# EAGLE design MasterOpAmp-design (EAGLE 6.4)

## Sheet 1 of 5
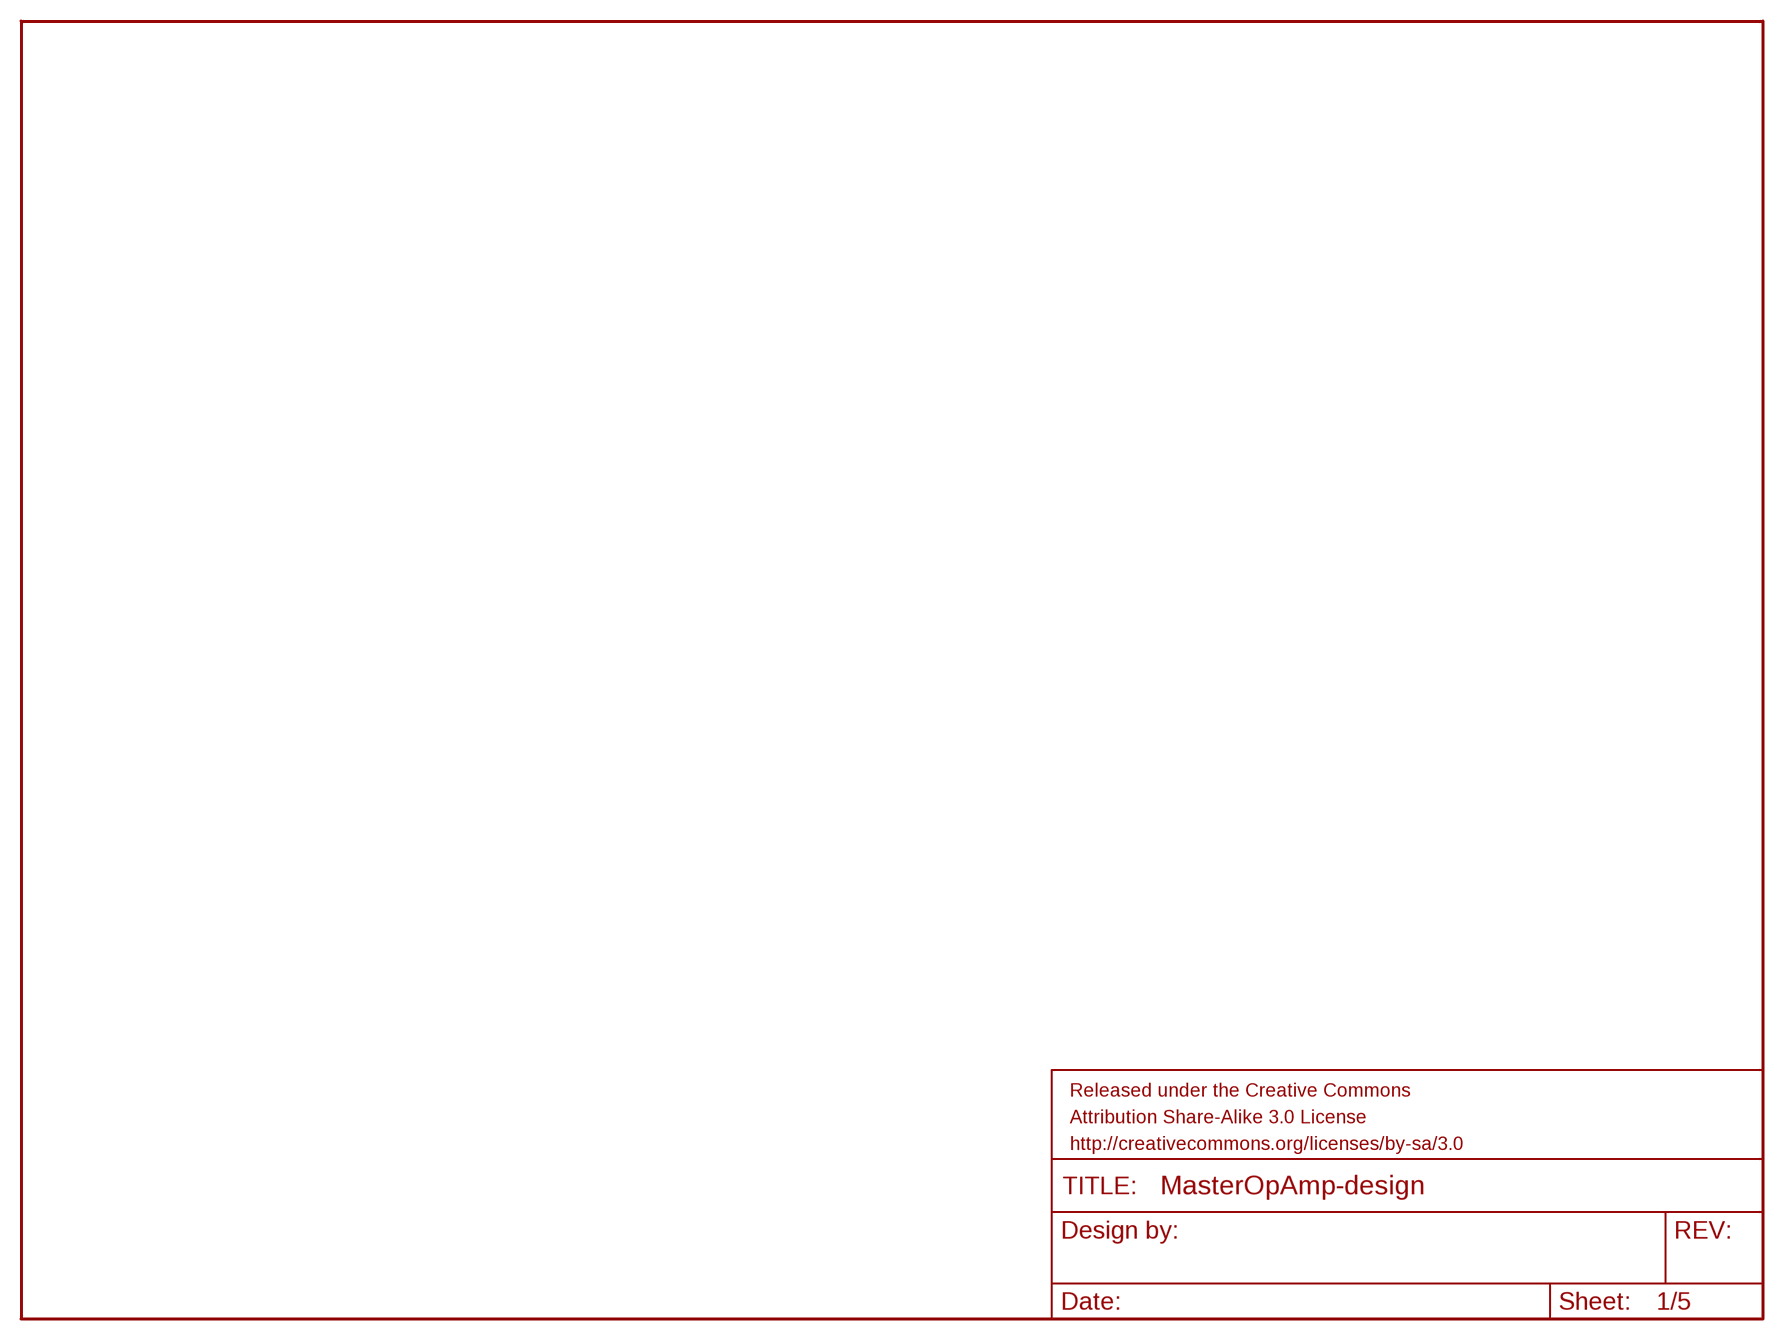
[diagram p0: schematic, sheet 1]

### Parts
FRAME1  FRAME-LETTER  [CREATIVE_COMMONS]

## Sheet 2 of 5
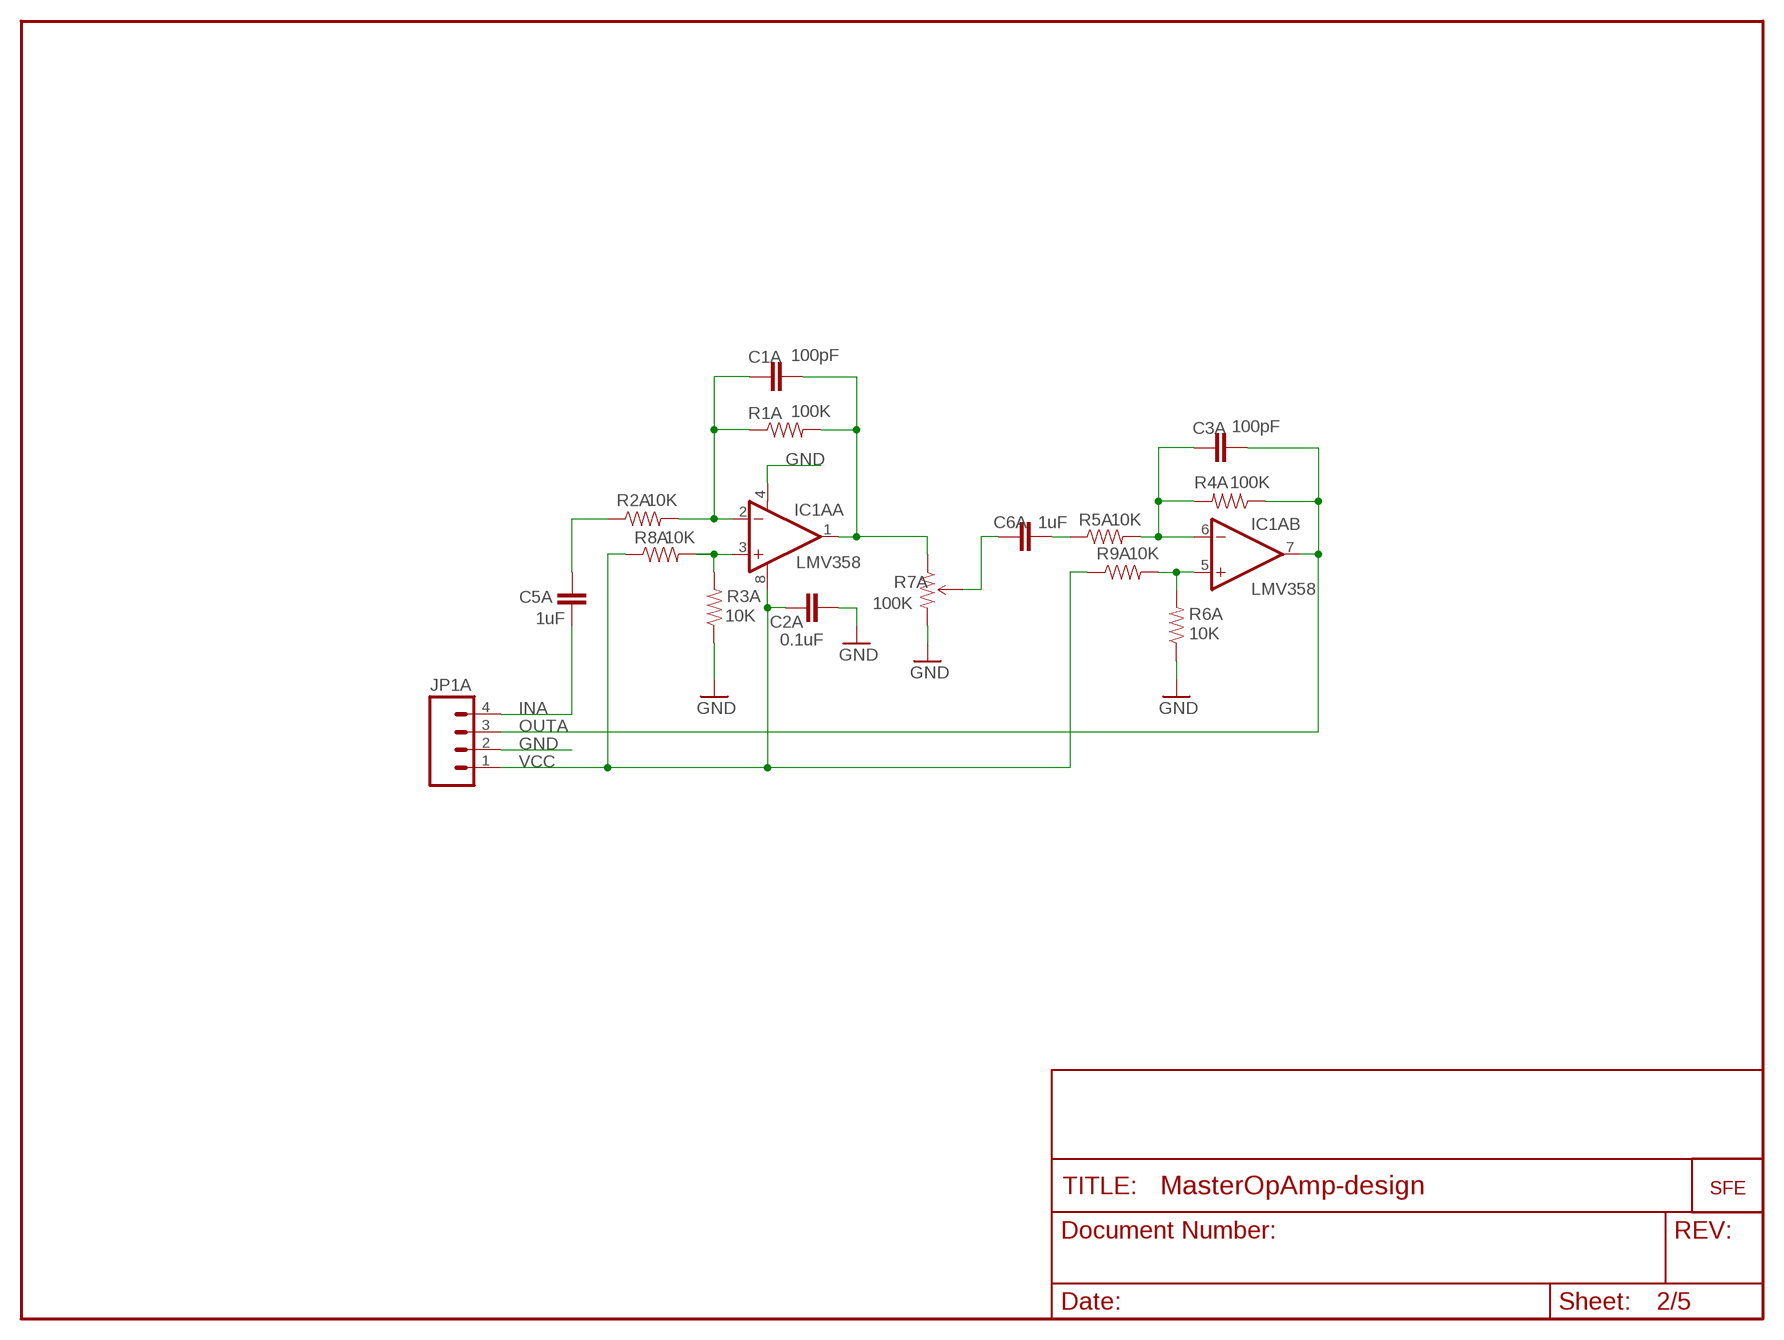
[diagram p1: schematic, sheet 2]

### Parts
C1A  100pF  CAP0402  [C0402]
C2A  0.1uF  CAP0402  [C0402]
C3A  100pF  CAP0402  [C0402]
C5A  1uF  CAP0402  [C0402]
C6A  1uF  CAP0402  [C0402]
IC1A  LMV358  OPAMP-DUALU  [SO08]
JP1A  M04PTH  [1X04]
R1A  100K  RESISTOR0402  [C0402]
R2A  10K  RESISTOR0402  [C0402]
R3A  10K  RESISTOR0402  [C0402]
R4A  100K  RESISTOR0402  [C0402]
R5A  10K  RESISTOR0402  [C0402]
R6A  10K  RESISTOR0402  [C0402]
R7A  100K  TRIMPOTSMD  [TRIMPOT-3MM]
R8A  10K  RESISTOR0402  [C0402]
R9A  10K  RESISTOR0402  [C0402]
U$3A  LOGO-SFENEW  [SFE-NEW-WEBLOGO]

### Nets
GND: C2A.2 IC1A.4(A:V-) JP1A.2 R3A.1 R6A.1 R7A.3(CW) ; also sheet 3,4,5
IN1A: C5A.2 R2A.1
INA: C5A.1 JP1A.4
N$1A: IC1A.5(B:+IN) R6A.2 R9A.2
N$2A: C1A.1 IC1A.2(A:-IN) R1A.1 R2A.2
N$3A: IC1A.3(A:+IN) R3A.2 R8A.2
N$4A: C6A.1 R5A.1
N$5A: C6A.2 R7A.2(WIPER)
N$7A: C3A.1 IC1A.6(B:-IN) R4A.2 R5A.2
OUT1A: C1A.2 IC1A.1(A:OUT) R1A.2 R7A.1(CCW)
OUTA: C3A.2 IC1A.7(B:OUT) JP1A.3 R4A.1
VCC: C2A.1 IC1A.8(A:V+) JP1A.1 R8A.1 R9A.1 ; also sheet 3,4,5

## Sheet 3 of 5
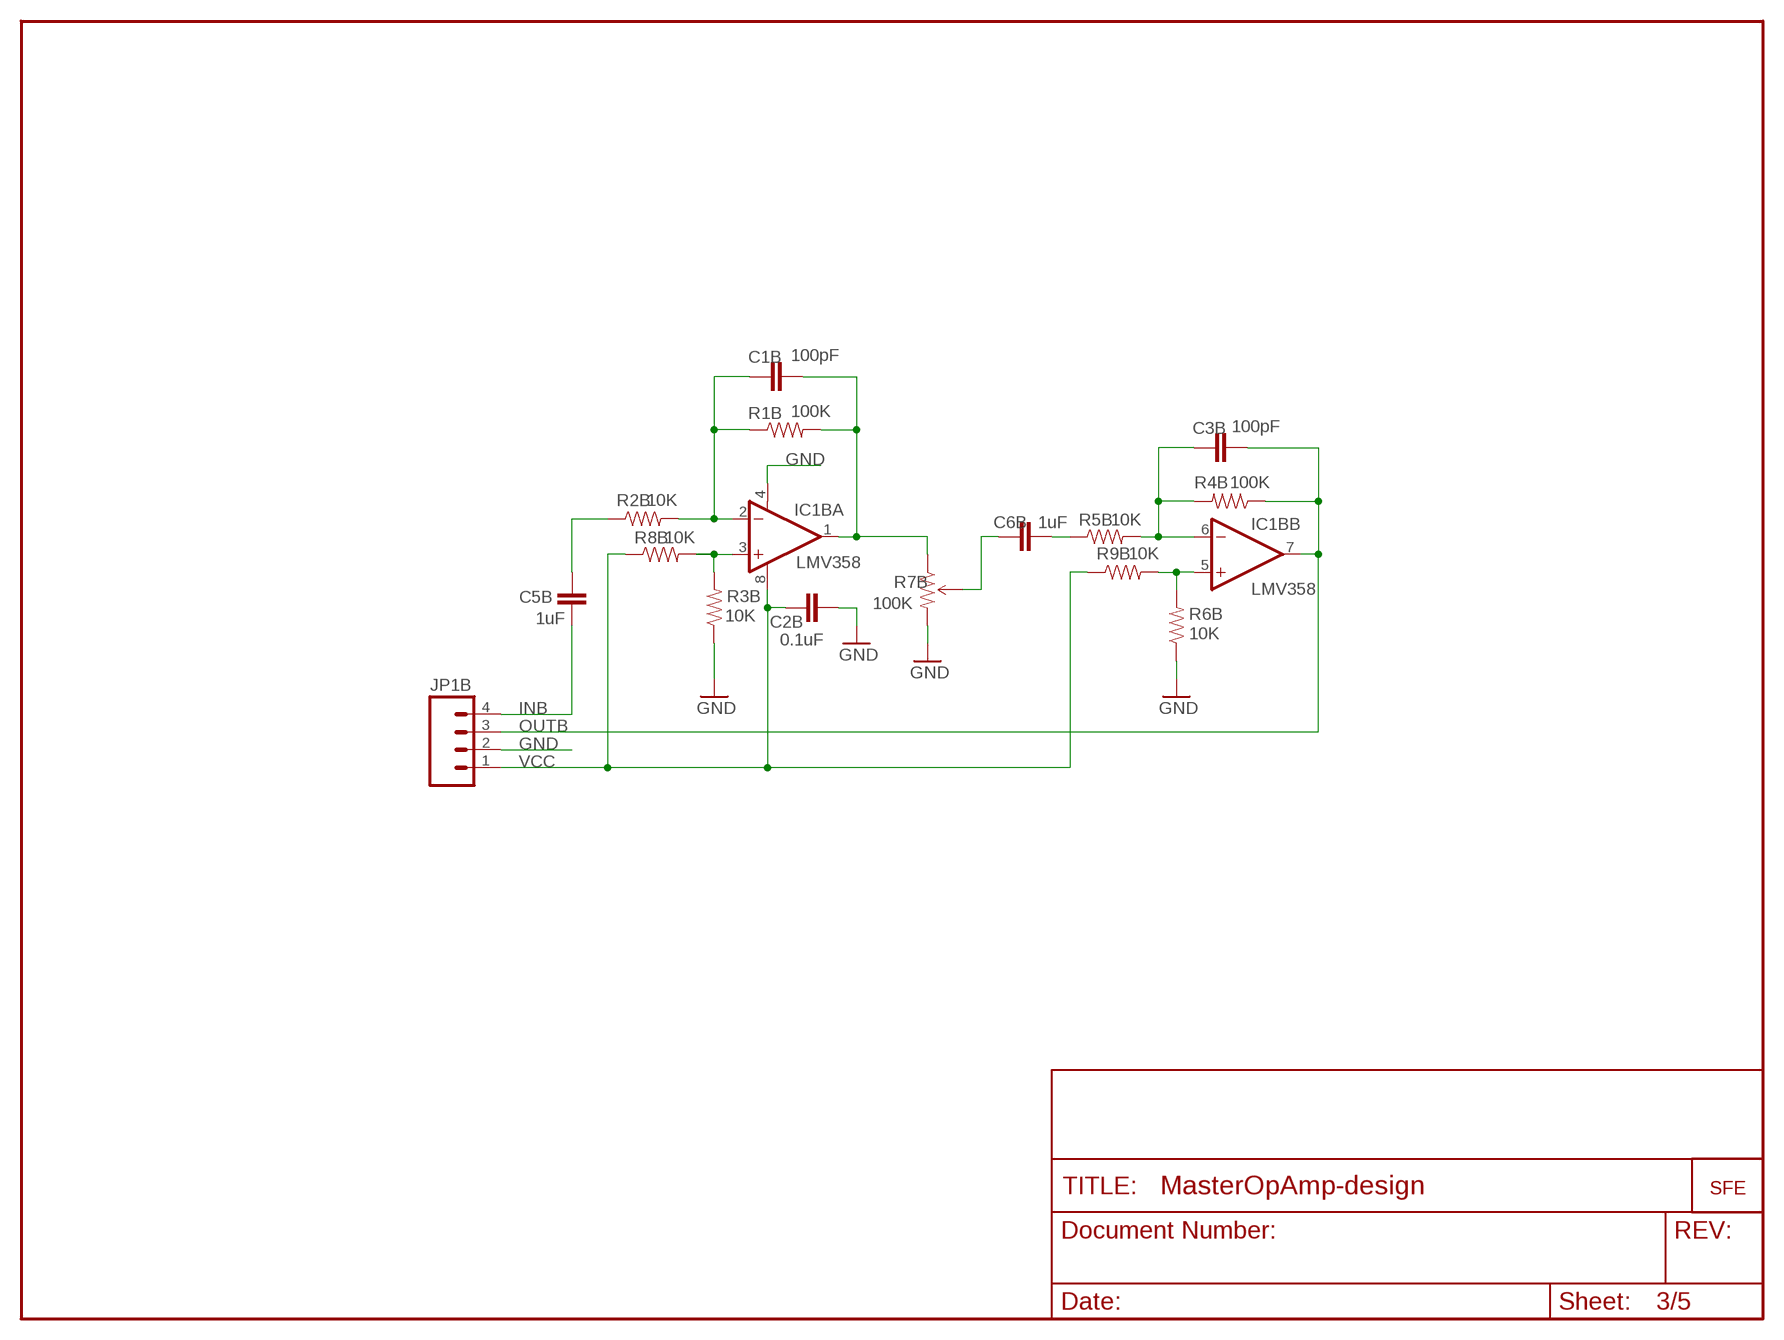
[diagram p2: schematic, sheet 3]

### Parts
C1B  100pF  CAP0402  [C0402]
C2B  0.1uF  CAP0402  [C0402]
C3B  100pF  CAP0402  [C0402]
C5B  1uF  CAP0402  [C0402]
C6B  1uF  CAP0402  [C0402]
IC1B  LMV358  OPAMP-DUALU  [SO08]
JP1B  M04PTH  [1X04]
R1B  100K  RESISTOR0402  [C0402]
R2B  10K  RESISTOR0402  [C0402]
R3B  10K  RESISTOR0402  [C0402]
R4B  100K  RESISTOR0402  [C0402]
R5B  10K  RESISTOR0402  [C0402]
R6B  10K  RESISTOR0402  [C0402]
R7B  100K  TRIMPOTSMD  [TRIMPOT-3MM]
R8B  10K  RESISTOR0402  [C0402]
R9B  10K  RESISTOR0402  [C0402]
U$3B  LOGO-SFENEW  [SFE-NEW-WEBLOGO]

### Nets
GND: C2B.2 IC1B.4(A:V-) JP1B.2 R3B.1 R6B.1 R7B.3(CW) ; also sheet 2,4,5
IN1B: C5B.2 R2B.1
INB: C5B.1 JP1B.4
N$1B: IC1B.5(B:+IN) R6B.2 R9B.2
N$2B: C1B.1 IC1B.2(A:-IN) R1B.1 R2B.2
N$3B: IC1B.3(A:+IN) R3B.2 R8B.2
N$4B: C6B.1 R5B.1
N$5B: C6B.2 R7B.2(WIPER)
N$7B: C3B.1 IC1B.6(B:-IN) R4B.2 R5B.2
OUT1B: C1B.2 IC1B.1(A:OUT) R1B.2 R7B.1(CCW)
OUTB: C3B.2 IC1B.7(B:OUT) JP1B.3 R4B.1
VCC: C2B.1 IC1B.8(A:V+) JP1B.1 R8B.1 R9B.1 ; also sheet 2,4,5

## Sheet 4 of 5
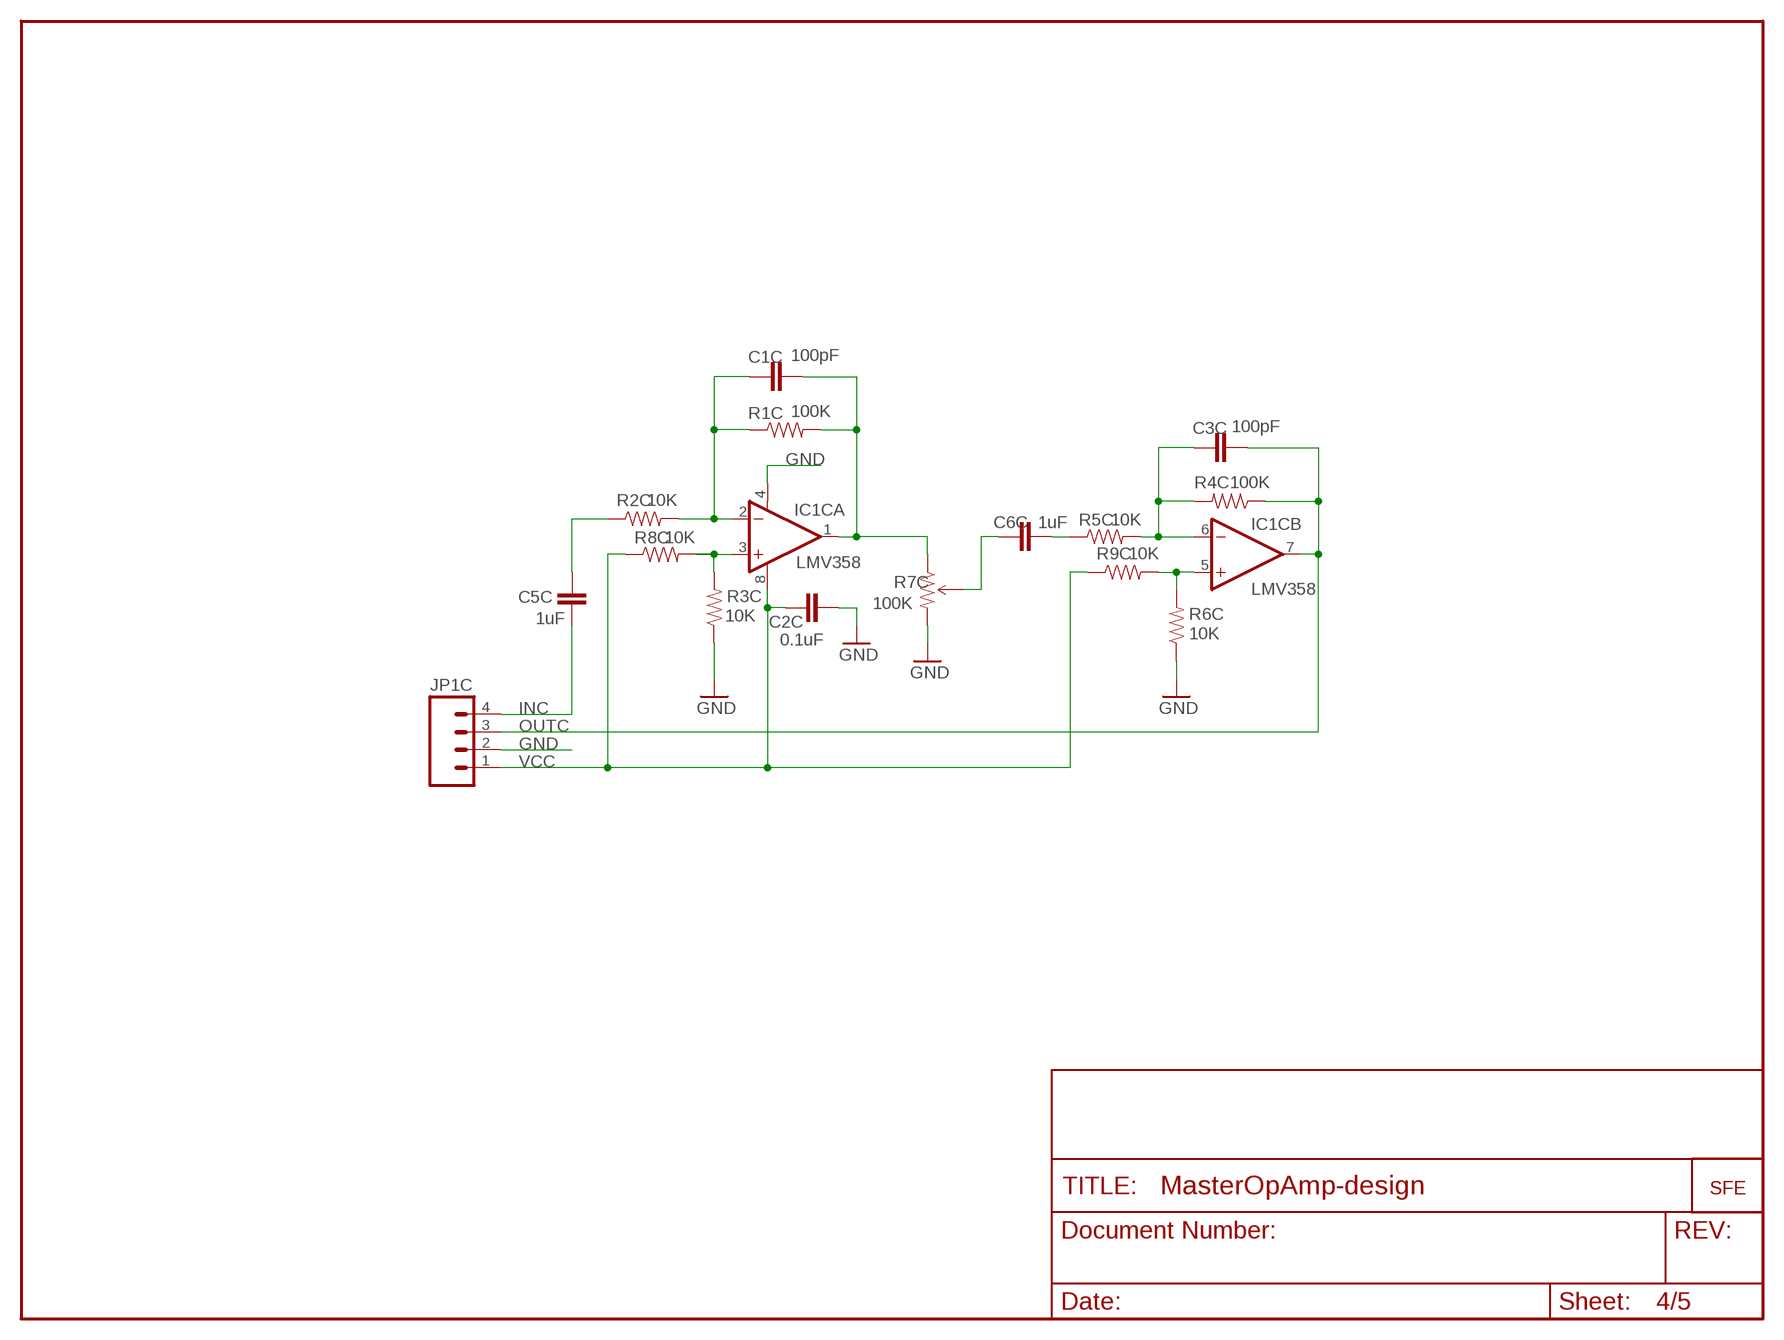
[diagram p3: schematic, sheet 4]

### Parts
C1C  100pF  CAP0402  [C0402]
C2C  0.1uF  CAP0402  [C0402]
C3C  100pF  CAP0402  [C0402]
C5C  1uF  CAP0402  [C0402]
C6C  1uF  CAP0402  [C0402]
IC1C  LMV358  OPAMP-DUALU  [SO08]
JP1C  M04PTH  [1X04]
R1C  100K  RESISTOR0402  [C0402]
R2C  10K  RESISTOR0402  [C0402]
R3C  10K  RESISTOR0402  [C0402]
R4C  100K  RESISTOR0402  [C0402]
R5C  10K  RESISTOR0402  [C0402]
R6C  10K  RESISTOR0402  [C0402]
R7C  100K  TRIMPOTSMD  [TRIMPOT-3MM]
R8C  10K  RESISTOR0402  [C0402]
R9C  10K  RESISTOR0402  [C0402]
U$3C  LOGO-SFENEW  [SFE-NEW-WEBLOGO]

### Nets
GND: C2C.2 IC1C.4(A:V-) JP1C.2 R3C.1 R6C.1 R7C.3(CW) ; also sheet 2,3,5
IN1C: C5C.2 R2C.1
INC: C5C.1 JP1C.4
N$1C: IC1C.5(B:+IN) R6C.2 R9C.2
N$2C: C1C.1 IC1C.2(A:-IN) R1C.1 R2C.2
N$3C: IC1C.3(A:+IN) R3C.2 R8C.2
N$4C: C6C.1 R5C.1
N$5C: C6C.2 R7C.2(WIPER)
N$7C: C3C.1 IC1C.6(B:-IN) R4C.2 R5C.2
OUT1C: C1C.2 IC1C.1(A:OUT) R1C.2 R7C.1(CCW)
OUTC: C3C.2 IC1C.7(B:OUT) JP1C.3 R4C.1
VCC: C2C.1 IC1C.8(A:V+) JP1C.1 R8C.1 R9C.1 ; also sheet 2,3,5

## Sheet 5 of 5
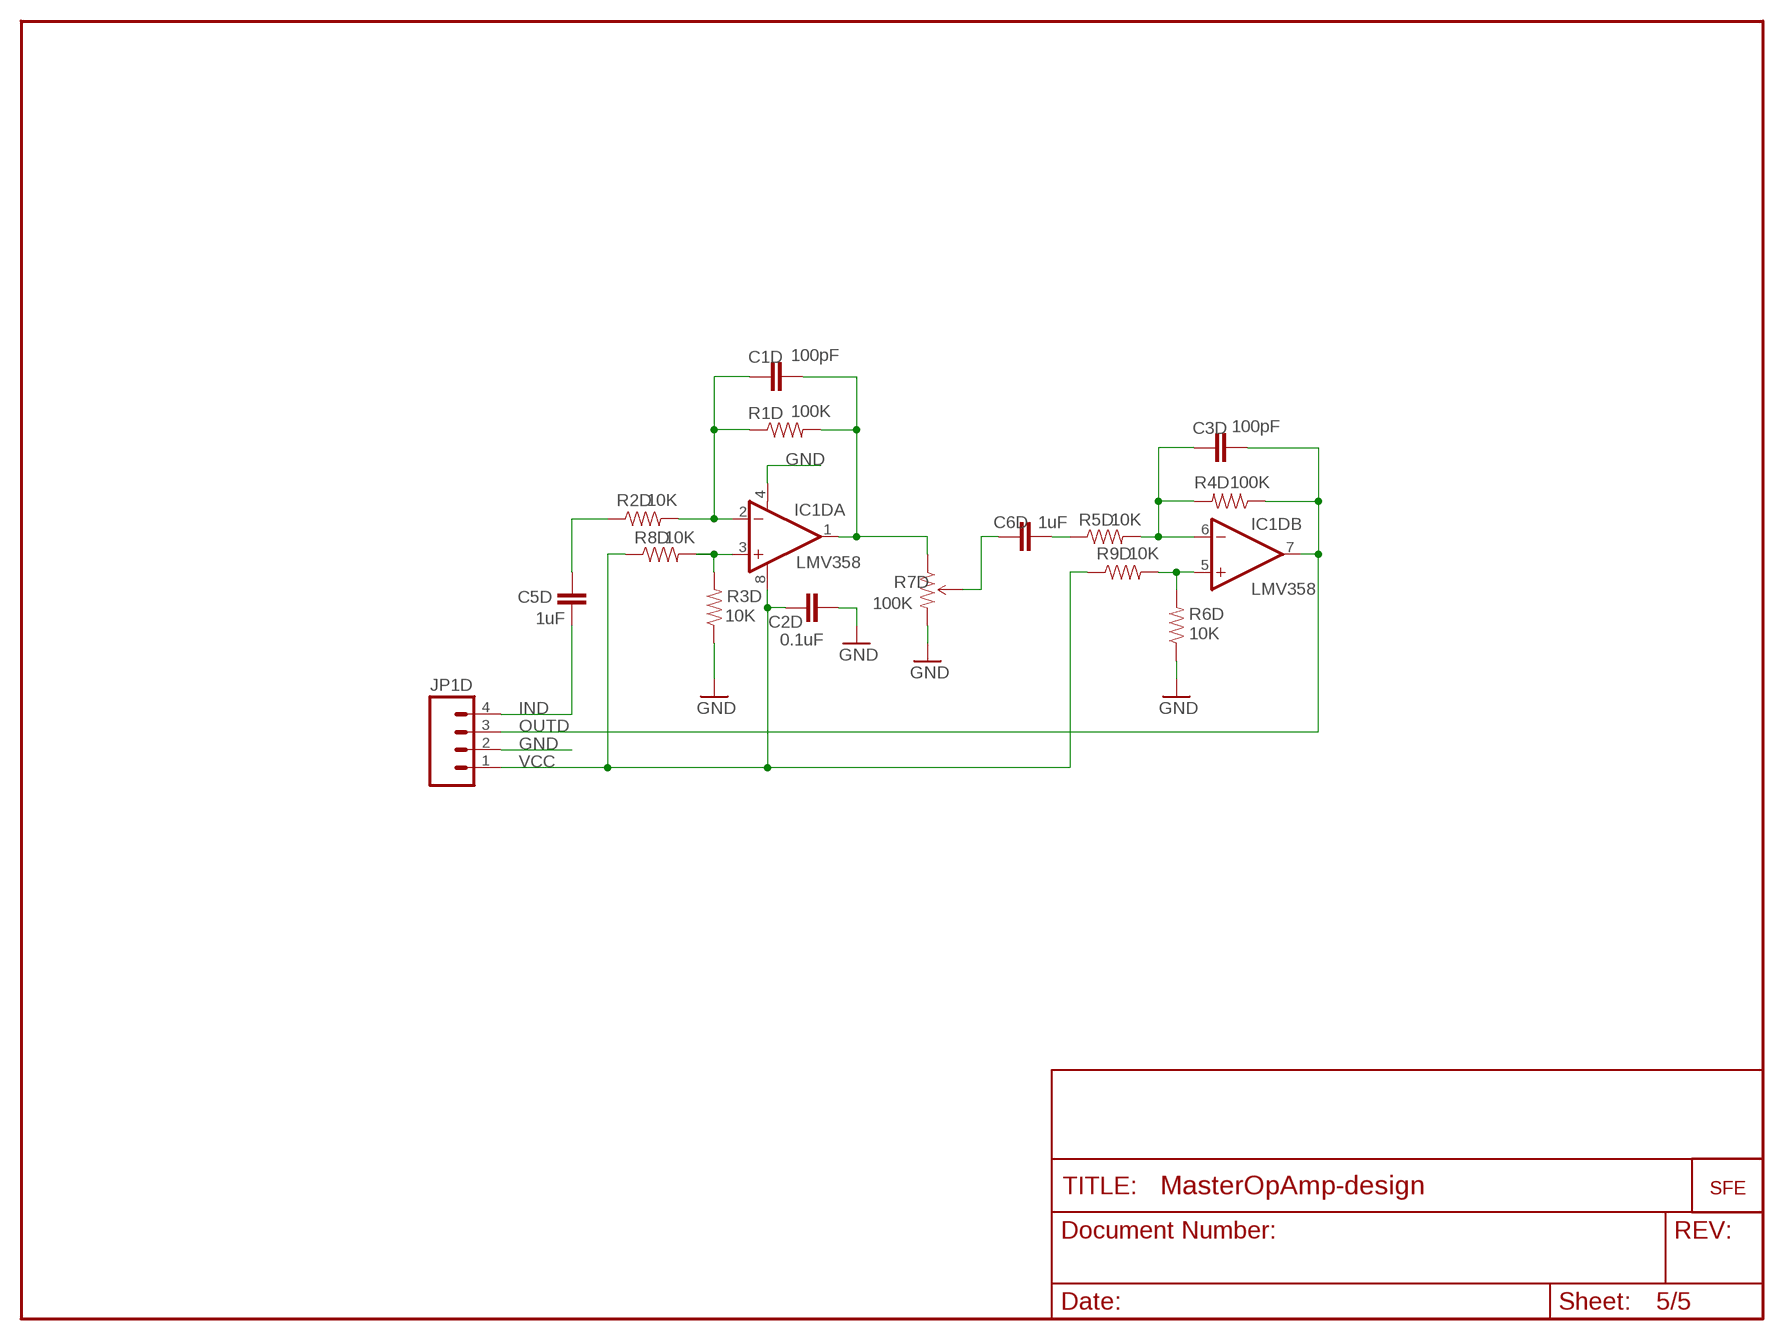
[diagram p4: schematic, sheet 5]

### Parts
C1D  100pF  CAP0402  [C0402]
C2D  0.1uF  CAP0402  [C0402]
C3D  100pF  CAP0402  [C0402]
C5D  1uF  CAP0402  [C0402]
C6D  1uF  CAP0402  [C0402]
IC1D  LMV358  OPAMP-DUALU  [SO08]
JP1D  M04PTH  [1X04]
R1D  100K  RESISTOR0402  [C0402]
R2D  10K  RESISTOR0402  [C0402]
R3D  10K  RESISTOR0402  [C0402]
R4D  100K  RESISTOR0402  [C0402]
R5D  10K  RESISTOR0402  [C0402]
R6D  10K  RESISTOR0402  [C0402]
R7D  100K  TRIMPOTSMD  [TRIMPOT-3MM]
R8D  10K  RESISTOR0402  [C0402]
R9D  10K  RESISTOR0402  [C0402]
U$3D  LOGO-SFENEW  [SFE-NEW-WEBLOGO]

### Nets
GND: C2D.2 IC1D.4(A:V-) JP1D.2 R3D.1 R6D.1 R7D.3(CW) ; also sheet 2,3,4
IN1D: C5D.2 R2D.1
IND: C5D.1 JP1D.4
N$1D: IC1D.5(B:+IN) R6D.2 R9D.2
N$2D: C1D.1 IC1D.2(A:-IN) R1D.1 R2D.2
N$3D: IC1D.3(A:+IN) R3D.2 R8D.2
N$4D: C6D.1 R5D.1
N$5D: C6D.2 R7D.2(WIPER)
N$7D: C3D.1 IC1D.6(B:-IN) R4D.2 R5D.2
OUT1D: C1D.2 IC1D.1(A:OUT) R1D.2 R7D.1(CCW)
OUTD: C3D.2 IC1D.7(B:OUT) JP1D.3 R4D.1
VCC: C2D.1 IC1D.8(A:V+) JP1D.1 R8D.1 R9D.1 ; also sheet 2,3,4

## Library data of the parts
C1A C1B C1C C1D C2A C2B C2C C2D C3A C3B C3C C3D C5A C5B C5C C5D C6A C6B C6C C6D = SparkFun:CAP: Capacitor Standard 0603 ceramic capacitor, and 0.1" leaded capacitor.
FRAME1 = SparkFun-Aesthetics:FRAME-LETTER: Schematic Frame Standard 8.5x11 US Letter frame
IC1A IC1B IC1C IC1D = SparkFun:OPAMP-DUAL: Operational Amplifier
JP1A JP1B JP1C JP1D = SparkFun:M04: Header 4 Standard 4-pin 0.1" header. Use with straight break away headers (SKU : PRT-00116), right angle break away headers (PRT-00553), swiss pins (PRT-00743), machine pins (PRT-00117), and female headers (PRT-00115). Molex polarized connector foot print use with SKU : PRT-08231 with associated crimp pins and housings.
R1A R1B R1C R1D R2A R2B R2C R2D R3A R3B R3C R3D R4A R4B R4C R4D R5A R5B R5C R5D R6A R6B R6C R6D = SparkFun:RESISTOR: Resistor Basic schematic elements and footprints for 0603, 1206, and PTH 1/10th watt (small) resistors.
R7A R7B R7C R7D = SparkFun:TRIMPOT
R8A R8B R8C R8D R9A R9B R9C R9D = SparkFun-DC:RESISTOR: Resistor Basic schematic elements and footprints for 0603, 1206, and PTH 1/10th watt (small) resistors.
U$3A U$3B U$3C U$3D = SparkFun:LOGO-SFE: Spark Fun Electronics PCB Logo This is the standard Spark Fun Electronics PCB logo.

## Board
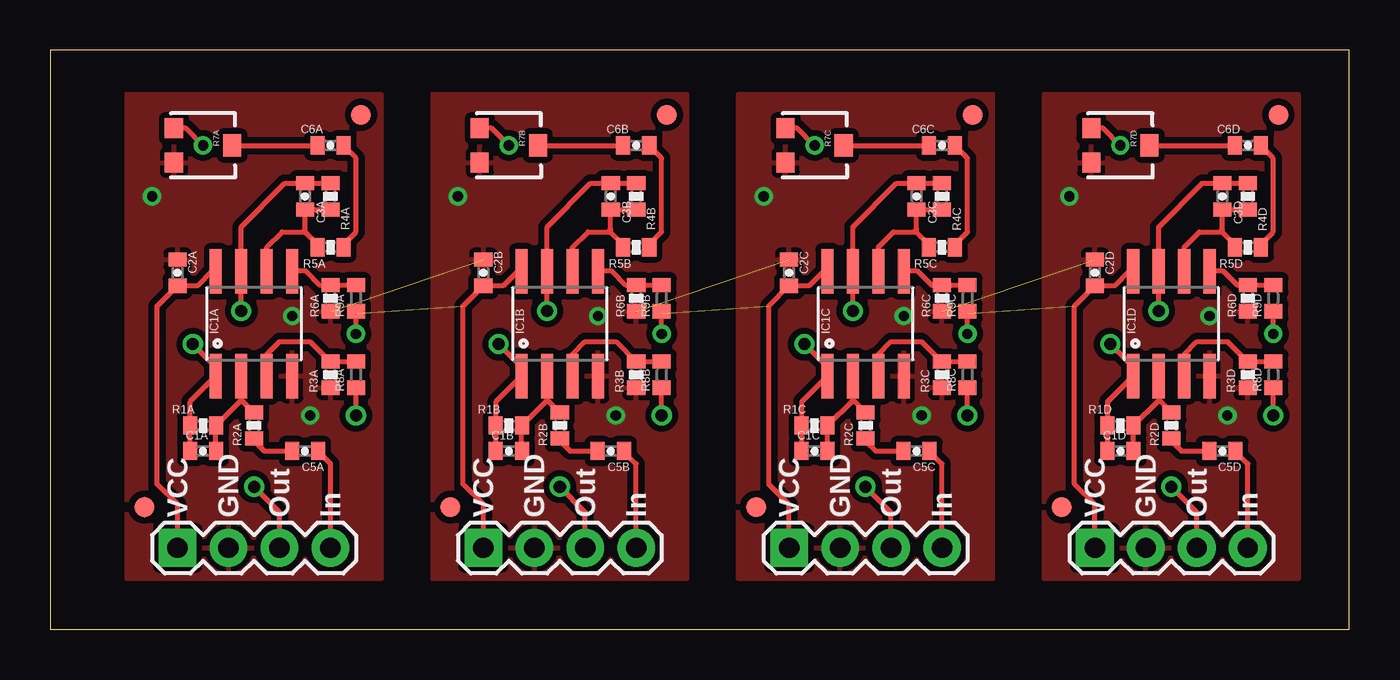
[diagram p5: board, top side]
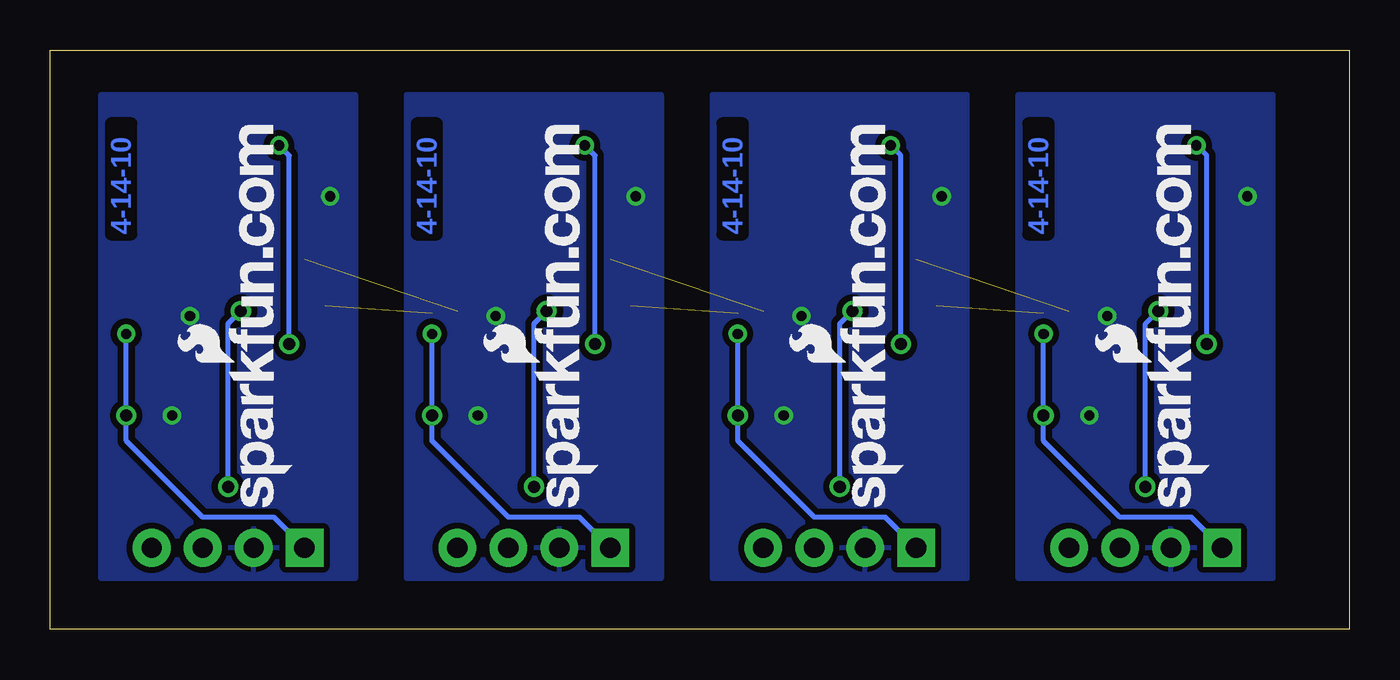
[diagram p6: board, bottom side, seen from below]

Size 64.75 x 28.88 mm. Coordinates in mm from the lower left corner, seen from the top.
Outline: 0,0 64.75,0 64.75,28.88 0,28.88 0,0
Copper layers (1*16): Top 0.035mm / dielectric 1.5mm / Bottom 0.035mm
Design rules "default": minimum track width 10mil, minimum drill 24mil, track to track 8mil, track to pad 8mil, pad to pad 8mil, via to via 8mil, smd to smd 8mil, copper to edge 40mil, drill to drill 8mil, minimum pad ring 10mil, minimum via ring 8mil, stop-mask expansion 4mil, vias tented up to drill 0mil, thermal gap 10mil

### Footprints (pad centres in the part's own frame; a part is rotated, then mirrored left to right if it is on the bottom)
0402-CAP = smd 0.7 x 0.9: 1 -0.65,0; 2 0.65,0
FIDUCIAL-1X2 = smd 1 x 1: 1 0,0
SO08@1 = smd 0.61 x 2.21: 1 -1.905,-2.616; 2 -0.635,-2.616; 3 0.635,-2.616; 4 1.905,-2.616; 5 1.905,2.616; 6 0.635,2.616; 7 -0.635,2.616; 8 -1.905,2.616
SO08@2 = smd 0.61 x 2.21: 1 -1.905,-2.616; 2 -0.635,-2.616; 3 0.635,-2.616; 4 1.905,-2.616; 5 1.905,2.616; 6 0.635,2.616; 7 -0.635,2.616; 8 -1.905,2.616
SO08@3 = smd 0.61 x 2.21: 1 -1.905,-2.616; 2 -0.635,-2.616; 3 0.635,-2.616; 4 1.905,-2.616; 5 1.905,2.616; 6 0.635,2.616; 7 -0.635,2.616; 8 -1.905,2.616
SO08 = smd 0.61 x 2.21: 1 -1.905,-2.616; 2 -0.635,-2.616; 3 0.635,-2.616; 4 1.905,-2.616; 5 1.905,2.616; 6 0.635,2.616; 7 -0.635,2.616; 8 -1.905,2.616
1X04@1 = drill 1.016 pad 1.88 square: 1 0,0 | drill 1.016 pad 1.88: 2 2.54,0; 3 5.08,0; 4 7.62,0
1X04@2 = drill 1.016 pad 1.88 square: 1 0,0 | drill 1.016 pad 1.88: 2 2.54,0; 3 5.08,0; 4 7.62,0
1X04@3 = drill 1.016 pad 1.88 square: 1 0,0 | drill 1.016 pad 1.88: 2 2.54,0; 3 5.08,0; 4 7.62,0
1X04 = drill 1.016 pad 1.88 square: 1 0,0 | drill 1.016 pad 1.88: 2 2.54,0; 3 5.08,0; 4 7.62,0
0402-RES = smd 0.7 x 0.9: 1 -0.65,0; 2 0.65,0
TRIMPOT-3MM = smd 1 x 0.9: 1 -0.85,-1.45; 3 0.85,-1.45 | smd 1.1 x 0.9: 2 0,1.45
C0402 = smd 0.7 x 0.9: 1 -0.65,0; 2 0.65,0

### Placement (x,y rotation side)
C1A  100pF  [0402-CAP]  7.62,8.89 180 top
C1B  100pF  [0402-CAP]  22.86,8.89 180 top
C1C  100pF  [0402-CAP]  38.1,8.89 180 top
C1D  100pF  [0402-CAP]  53.34,8.89 180 top
C2A  0.1uF  [0402-CAP]  6.35,17.78 90 top
C2B  0.1uF  [0402-CAP]  21.59,17.78 90 top
C2C  0.1uF  [0402-CAP]  36.83,17.78 90 top
C2D  0.1uF  [0402-CAP]  52.07,17.78 90 top
C3A  100pF  [0402-CAP]  12.7,21.59 90 top
C3B  100pF  [0402-CAP]  27.94,21.59 90 top
C3C  100pF  [0402-CAP]  43.18,21.59 90 top
C3D  100pF  [0402-CAP]  58.42,21.59 90 top
C5A  1uF  [0402-CAP]  12.7,8.89 180 top
C5B  1uF  [0402-CAP]  27.94,8.89 180 top
C5C  1uF  [0402-CAP]  43.18,8.89 180 top
C5D  1uF  [0402-CAP]  58.42,8.89 180 top
C6A  1uF  [0402-CAP]  13.97,24.13 180 top
C6B  1uF  [0402-CAP]  29.21,24.13 180 top
C6C  1uF  [0402-CAP]  44.45,24.13 180 top
C6D  1uF  [0402-CAP]  59.69,24.13 180 top
E$1A  [FIDUCIAL-1X2]  15.49,25.65 0 top
E$1B  [FIDUCIAL-1X2]  30.73,25.65 0 top
E$1C  [FIDUCIAL-1X2]  45.97,25.65 0 top
E$1D  [FIDUCIAL-1X2]  61.21,25.65 0 top
E$2A  [FIDUCIAL-1X2]  4.7,6.1 0 top
E$2B  [FIDUCIAL-1X2]  19.94,6.1 0 top
E$2C  [FIDUCIAL-1X2]  35.18,6.1 0 top
E$2D  [FIDUCIAL-1X2]  50.42,6.1 0 top
FRAME1  21.59,-7.62 0 top  (outside the outline)
IC1A  LMV358  [SO08@1]  10.16,15.24 0 top
IC1B  LMV358  [SO08@2]  25.4,15.24 0 top
IC1C  LMV358  [SO08@3]  40.64,15.24 0 top
IC1D  55.88,15.24 0 top
JP1A  [1X04@1]  6.35,4.06 0 top
JP1B  [1X04@2]  21.59,4.06 0 top
JP1C  [1X04@3]  36.83,4.06 0 top
JP1D  52.07,4.06 0 top
R1A  100K  [0402-RES]  7.62,10.16 180 top
R1B  100K  [0402-RES]  22.86,10.16 180 top
R1C  100K  [0402-RES]  38.1,10.16 180 top
R1D  100K  [0402-RES]  53.34,10.16 180 top
R2A  10K  [0402-RES]  10.16,10.16 90 top
R2B  10K  [0402-RES]  25.4,10.16 90 top
R2C  10K  [0402-RES]  40.64,10.16 90 top
R2D  10K  [0402-RES]  55.88,10.16 90 top
R3A  10K  [0402-RES]  13.97,12.7 90 top
R3B  10K  [0402-RES]  29.21,12.7 90 top
R3C  10K  [0402-RES]  44.45,12.7 90 top
R3D  10K  [0402-RES]  59.69,12.7 90 top
R4A  100K  [0402-RES]  13.97,21.59 270 top
R4B  100K  [0402-RES]  29.21,21.59 270 top
R4C  100K  [0402-RES]  44.45,21.59 270 top
R4D  100K  [0402-RES]  59.69,21.59 270 top
R5A  10K  [0402-RES]  13.97,19.05 180 top
R5B  10K  [0402-RES]  29.21,19.05 180 top
R5C  10K  [0402-RES]  44.45,19.05 180 top
R5D  10K  [0402-RES]  59.69,19.05 180 top
R6A  10K  [0402-RES]  13.97,16.51 90 top
R6B  10K  [0402-RES]  29.21,16.51 90 top
R6C  10K  [0402-RES]  44.45,16.51 90 top
R6D  10K  [0402-RES]  59.69,16.51 90 top
R7A  7.62,24.13 270 top
R7B  22.86,24.13 270 top
R7C  38.1,24.13 270 top
R7D  53.34,24.13 270 top
R8A  15.24,12.7 90 top
R8B  30.48,12.7 90 top
R8C  45.72,12.7 90 top
R8D  60.96,12.7 90 top
R9A  15.24,16.51 90 top
R9B  30.48,16.51 90 top
R9C  45.72,16.51 90 top
R9D  60.96,16.51 90 top
U$3A  6.98,6.11 90 bottom
U$3B  22.22,6.11 90 bottom
U$3C  37.46,6.11 90 bottom
U$3D  52.7,6.11 90 bottom

### Tracks (layer width: path | path; a pad name or v marks a point on that pad's centre or on a via)
GND  (via drill 0.51)  (3 unrouted)
  other vias: 5.08,21.59 12.06,15.62 12.95,10.67 20.32,21.59 27.3,15.62 28.19,10.67 35.56,21.59 42.55,15.62 43.43,10.67 50.8,21.59 57.78,15.62 58.67,10.67
  pour Top (isolate 0.305): 3.81,2.54 16.51,2.54 16.51,26.67 3.81,26.67
  pour Bottom (isolate 0.305): 3.81,2.54 16.51,2.54 16.51,26.67 3.81,26.67
  pour Bottom (isolate 0.305): 3.81,2.54 3.81,26.67 16.51,26.67 16.51,2.54
  pour Top (isolate 0.305): 19.05,2.54 31.75,2.54 31.75,26.67 19.05,26.67
  pour Bottom (isolate 0.305): 19.05,2.54 31.75,2.54 31.75,26.67 19.05,26.67
  pour Bottom (isolate 0.305): 19.05,2.54 19.05,26.67 31.75,26.67 31.75,2.54
  pour Top (isolate 0.305): 34.29,2.54 46.99,2.54 46.99,26.67 34.29,26.67
  pour Bottom (isolate 0.305): 34.29,2.54 46.99,2.54 46.99,26.67 34.29,26.67
  pour Bottom (isolate 0.305): 34.29,2.54 34.29,26.67 46.99,26.67 46.99,2.54
  pour Top (isolate 0.305): 49.53,2.54 62.23,2.54 62.23,26.67 49.53,26.67
  pour Bottom (isolate 0.305): 49.53,2.54 62.23,2.54 62.23,26.67 49.53,26.67
  pour Bottom (isolate 0.305): 49.53,2.54 49.53,26.67 62.23,26.67 62.23,2.54
IN1A
  Top 0.254: R2A.1 10.16,9.4 10.67,8.89 C5A.2
IN1B
  Top 0.254: R2B.1 25.4,9.4 25.91,8.89 C5B.2
IN1C
  Top 0.254: R2C.1 40.64,9.4 41.15,8.89 C5C.2
IN1D
  Top 0.254: R2D.1 55.88,9.4 56.39,8.89 C5D.2
INA
  Top 0.254: C5A.1 13.34,8.89 13.97,8.26 JP1A.4
INB
  Top 0.254: C5B.1 28.57,8.89 29.21,8.26 JP1B.4
INC
  Top 0.254: C5C.1 43.81,8.89 44.45,8.26 JP1C.4
IND
  Top 0.254: C5D.1 59.05,8.89 59.69,8.26 JP1D.4
N$1A
  Top 0.254: R6A.2 13.86,17.16 13.84,17.14 | R6A.2 R9A.2 | IC1A.5 12.75,17.86 13.46,17.14 13.72,17.14 13.84,17.27 13.96,17.16 R6A.2
N$1B
  Top 0.254: R6B.2 29.1,17.16 29.08,17.14 | R6B.2 R9B.2 | IC1B.5 27.99,17.86 28.7,17.14 28.96,17.14 29.08,17.27 29.2,17.16 R6B.2
N$1C
  Top 0.254: R6C.2 44.34,17.16 44.32,17.14 | R6C.2 R9C.2 | IC1C.5 43.23,17.86 43.94,17.14 44.2,17.14 44.32,17.27 44.44,17.16 R6C.2
N$1D
  Top 0.254: R6D.2 59.58,17.16 59.56,17.14 | R6D.2 R9D.2 | IC1D.5 58.47,17.86 59.18,17.14 59.44,17.14 59.56,17.27 59.67,17.16 R6D.2
N$2A
  Top 0.254: 9.87,10.71 R2A.2 10.16,10.79 9.53,11.43 | 9.53,11.43 IC1A.2 | 9.53,11.43 9.53,11.41 R1A.1 8.26,10.16 8.26,8.9 C1A.1
N$2B
  Top 0.254: 25.11,10.71 R2B.2 25.4,10.79 24.77,11.43 | 24.77,11.43 IC1B.2 | 24.77,11.43 24.77,11.41 R1B.1 23.5,10.16 23.5,8.9 C1B.1
N$2C
  Top 0.254: 40.35,10.71 R2C.2 40.64,10.79 40.01,11.43 | 40.01,11.43 IC1C.2 | 40.01,11.43 40.01,11.41 R1C.1 38.73,10.16 38.73,8.9 C1C.1
N$2D
  Top 0.254: 55.59,10.71 R2D.2 55.88,10.79 55.24,11.43 | 55.24,11.43 IC1D.2 | 55.24,11.43 55.24,11.41 R1D.1 53.98,10.16 53.98,8.9 C1D.1
N$3A
  Top 0.254: R3A.2 13.86,13.35 13.84,13.34 | R3A.2 R8A.2 | IC1A.3 10.79,13.72 11.43,14.35 12.95,14.35 13.97,13.34 R3A.2
N$3B
  Top 0.254: R3B.2 29.1,13.35 29.08,13.34 | R3B.2 R8B.2 | IC1B.3 26.04,13.72 26.67,14.35 28.19,14.35 29.21,13.34 R3B.2
N$3C
  Top 0.254: R3C.2 44.34,13.35 44.32,13.34 | R3C.2 R8C.2 | IC1C.3 41.27,13.72 41.91,14.35 43.43,14.35 44.45,13.34 R3C.2
N$3D
  Top 0.254: R3D.2 59.58,13.35 59.56,13.34 | R3D.2 R8D.2 | IC1D.3 56.52,13.72 57.15,14.35 58.67,14.35 59.69,13.34 R3D.2
N$4A
  Top 0.254: R5A.1 14.62,19.19 15.24,19.81 15.24,23.5 14.61,24.13 C6A.1
N$4B
  Top 0.254: R5B.1 29.86,19.19 30.48,19.81 30.48,23.5 29.84,24.13 C6B.1
N$4C
  Top 0.254: R5C.1 45.1,19.19 45.72,19.81 45.72,23.5 45.09,24.13 C6C.1
N$4D
  Top 0.254: R5D.1 60.34,19.19 60.96,19.81 60.96,23.5 60.33,24.13 C6D.1
N$5A
  Top 0.254: R7A.2 C6A.2
N$5B
  Top 0.254: R7B.2 C6B.2
N$5C
  Top 0.254: R7C.2 C6C.2
N$5D
  Top 0.254: R7D.2 C6D.2
N$7A
  Top 0.254: IC1A.6 10.79,19.05 11.56,19.81 12.57,19.81 | R5A.2 13.32,19.16 13.34,19.18 12.7,19.81 12.57,19.81 | 12.57,19.81 12.7,19.94 C3A.1 13.96,20.94 13.97,20.95 R4A.2
N$7B
  Top 0.254: IC1B.6 26.04,19.05 26.8,19.81 27.81,19.81 | R5B.2 28.56,19.16 28.57,19.18 27.94,19.81 27.81,19.81 | 27.81,19.81 27.94,19.94 C3B.1 29.2,20.94 29.21,20.95 R4B.2
N$7C
  Top 0.254: IC1C.6 41.27,19.05 42.04,19.81 43.05,19.81 | R5C.2 43.8,19.16 43.81,19.18 43.18,19.81 43.05,19.81 | 43.05,19.81 43.18,19.94 C3C.1 44.44,20.94 44.45,20.95 R4C.2
N$7D
  Top 0.254: IC1D.6 56.52,19.05 57.28,19.81 58.29,19.81 | R5D.2 59.04,19.16 59.05,19.18 58.42,19.81 58.29,19.81 | 58.29,19.81 58.42,19.94 C3D.1 59.67,20.94 59.69,20.95 R4D.2
OUT1A  (via drill 0.51, 0.6)
  Top 0.254: C1A.2 6.99,8.89 6.99,10.14 R1A.2 6.99,10.16 6.99,11.35 IC1A.1 8.26,13.08 v7.11,14.22 | v7.62,24.13 6.77,24.98 R7A.1
  Bottom 0.254: v7.11,14.22 7.11,23.62 v7.62,24.13
OUT1B  (via drill 0.51, 0.6)
  Top 0.254: C1B.2 22.23,8.89 22.23,10.14 R1B.2 22.23,10.16 22.23,11.35 IC1B.1 23.5,13.08 v22.35,14.22 | v22.86,24.13 22.01,24.98 R7B.1
  Bottom 0.254: v22.35,14.22 22.35,23.62 v22.86,24.13
OUT1C  (via drill 0.51, 0.6)
  Top 0.254: C1C.2 37.47,8.89 37.47,10.14 R1C.2 37.47,10.16 37.47,11.35 IC1C.1 38.73,13.08 v37.59,14.22 | v38.1,24.13 37.25,24.98 R7C.1
  Bottom 0.254: v37.59,14.22 37.59,23.62 v38.1,24.13
OUT1D  (via drill 0.51, 0.6)
  Top 0.254: C1D.2 52.7,8.89 52.7,10.14 R1D.2 52.7,10.16 52.7,11.35 IC1D.1 53.98,13.08 v52.83,14.22 | v53.34,24.13 52.49,24.98 R7D.1
  Bottom 0.254: v52.83,14.22 52.83,23.62 v53.34,24.13
OUTA  (via drill 0.6)
  Top 0.254: R4A.1 12.71,22.24 12.7,22.23 C3A.2 11.7,22.24 9.53,20.07 IC1A.7 v9.53,15.88 | JP1A.3 11.43,5.84 v10.16,7.11
  Bottom 0.254: v10.16,7.11 10.16,15.24 v9.53,15.88
OUTB  (via drill 0.6)
  Top 0.254: R4B.1 27.95,22.24 27.94,22.23 C3B.2 26.94,22.24 24.77,20.07 IC1B.7 v24.77,15.88 | JP1B.3 26.67,5.84 v25.4,7.11
  Bottom 0.254: v25.4,7.11 25.4,15.24 v24.77,15.88
OUTC  (via drill 0.6)
  Top 0.254: R4C.1 43.2,22.24 43.18,22.23 C3C.2 42.18,22.24 40.01,20.07 IC1C.7 v40.01,15.88 | JP1C.3 41.91,5.84 v40.64,7.11
  Bottom 0.254: v40.64,7.11 40.64,15.24 v40.01,15.88
OUTD  (via drill 0.6)
  Top 0.254: R4D.1 58.44,22.24 58.42,22.23 C3D.2 57.42,22.24 55.24,20.07 IC1D.7 v55.24,15.88 | JP1D.3 57.15,5.84 v55.88,7.11
  Bottom 0.254: v55.88,7.11 55.88,15.24 v55.24,15.88
VCC  (via drill 0.51, 0.6)  (3 unrouted)
  Top 0.254: 15.24,15.75 15.17,15.75 R9A.1 | v15.24,10.67 15.24,12.19 15.17,12.19 R8A.1 | JP1A.1 6.35,6.22 5.33,7.24 5.33,16.13 6.35,17.14 | IC1A.8 8.08,17.86 7.37,17.14 6.35,17.14 | 6.35,17.14 C2A.1 | R9A.1 15.24,15.88 | v15.24,14.73 R9A.1 | 30.48,15.75 30.41,15.75 R9B.1 | v30.48,10.67 30.48,12.19 30.41,12.19 R8B.1 | JP1B.1 21.59,6.22 20.57,7.24 20.57,16.13 21.59,17.14 | IC1B.8 23.32,17.86 22.61,17.14 21.59,17.14 | 21.59,17.14 C2B.1 | R9B.1 30.48,15.88 | v30.48,14.73 R9B.1 | 45.72,15.75 45.65,15.75 R9C.1 | v45.72,10.67 45.72,12.19 45.65,12.19 R8C.1 | JP1C.1 36.83,6.22 35.81,7.24 35.81,16.13 36.83,17.14 | IC1C.8 38.56,17.86 37.85,17.14 36.83,17.14 | 36.83,17.14 C2C.1 | R9C.1 45.72,15.88 | v45.72,14.73 R9C.1 | 60.96,15.75 60.89,15.75 R9D.1 | v60.96,10.67 60.96,12.19 60.89,12.19 R8D.1 | JP1D.1 52.07,6.22 51.05,7.24 51.05,16.13 52.07,17.14 | IC1D.8 53.8,17.86 53.09,17.14 52.07,17.14 | 52.07,17.14 C2D.1 | R9D.1 60.96,15.88 | v60.96,14.73 R9D.1
  Bottom 0.254: JP1A.1 7.87,5.59 11.43,5.59 15.24,9.4 v15.24,10.67 v15.24,14.73 | JP1B.1 23.11,5.59 26.67,5.59 30.48,9.4 v30.48,10.67 v30.48,14.73 | JP1C.1 38.35,5.59 41.91,5.59 45.72,9.4 v45.72,10.67 v45.72,14.73 | JP1D.1 53.59,5.59 57.15,5.59 60.96,9.4 v60.96,10.67 v60.96,14.73

### Text on the board
Bottom: 4-14-10 | 4-14-10 | 4-14-10 | 4-14-10
tPlace: VCC | GND | Out | In | VCC | GND | Out | In | VCC | GND | Out | In | VCC | GND | Out | In
tValues: 100K trimpot | 100K trimpot | 100K trimpot | 100K trimpot | LMV358 | LMV358 | LMV358 | LMV358